# EAGLE design power_injector 0.7 (EAGLE 6.6.0)
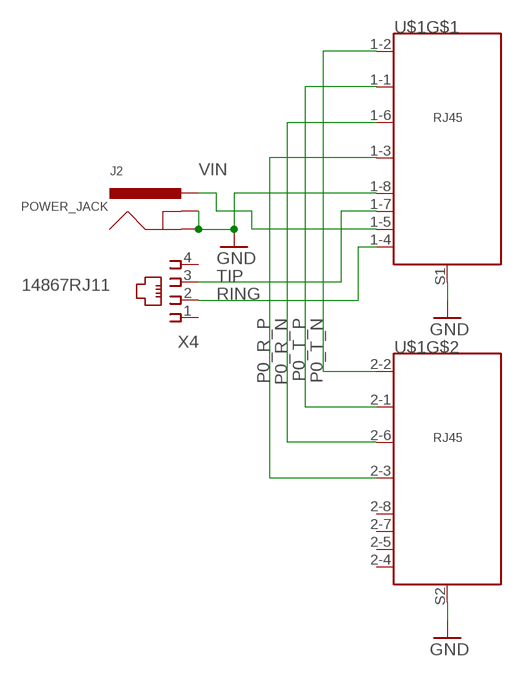
[diagram p0: schematic, sheet 1]

## Parts
J2  POWER_JACK  [POWER_JACK_SLOT1]
U$1  ETHERNET_2PORT  [ETHERNET-1X2]
X4  14867RJ11  [14867]

## Nets
GND: J2.GND@1(GNDBREAK) J2.GND@2(GND) U$1.1-8 U$1.S1(SHIELD) U$1.S2(SHIELD)
P0_R_N: U$1.1-6 U$1.2-6
P0_R_P: U$1.1-3 U$1.2-3
P0_T_N: U$1.1-2 U$1.2-2
P0_T_P: U$1.1-1 U$1.2-1
RING: U$1.1-4 X4.2
TIP: U$1.1-7 X4.3
VIN: J2.PWR U$1.1-5
Unconnected: U$1.2-4 U$1.2-5 U$1.2-7 U$1.2-8 X4.1 X4.4

## Library data of the parts
J2 = dragino:POWER_JACK: Power Jack This is the standard 5.5mm barrel jack for power. The PTH is the most common, proven, reliable, footprint. All others are experimental. The Slot footprint only works if the mill layer is transmitted to the PCB fab house so be warned. Spark Fun Electronics SKU : PRT-00119. Mating wall wart : TOL-00298 (and others)
U$1 = dragino-passive:ETHERNET_2PORT
X4 = dragino:14867: RJ11 Connector Source: 4UCON TECHNOLOGY INC. 14867.pdf; OC_FARNELL: unknown; OC_NEWARK: unknown

## Board
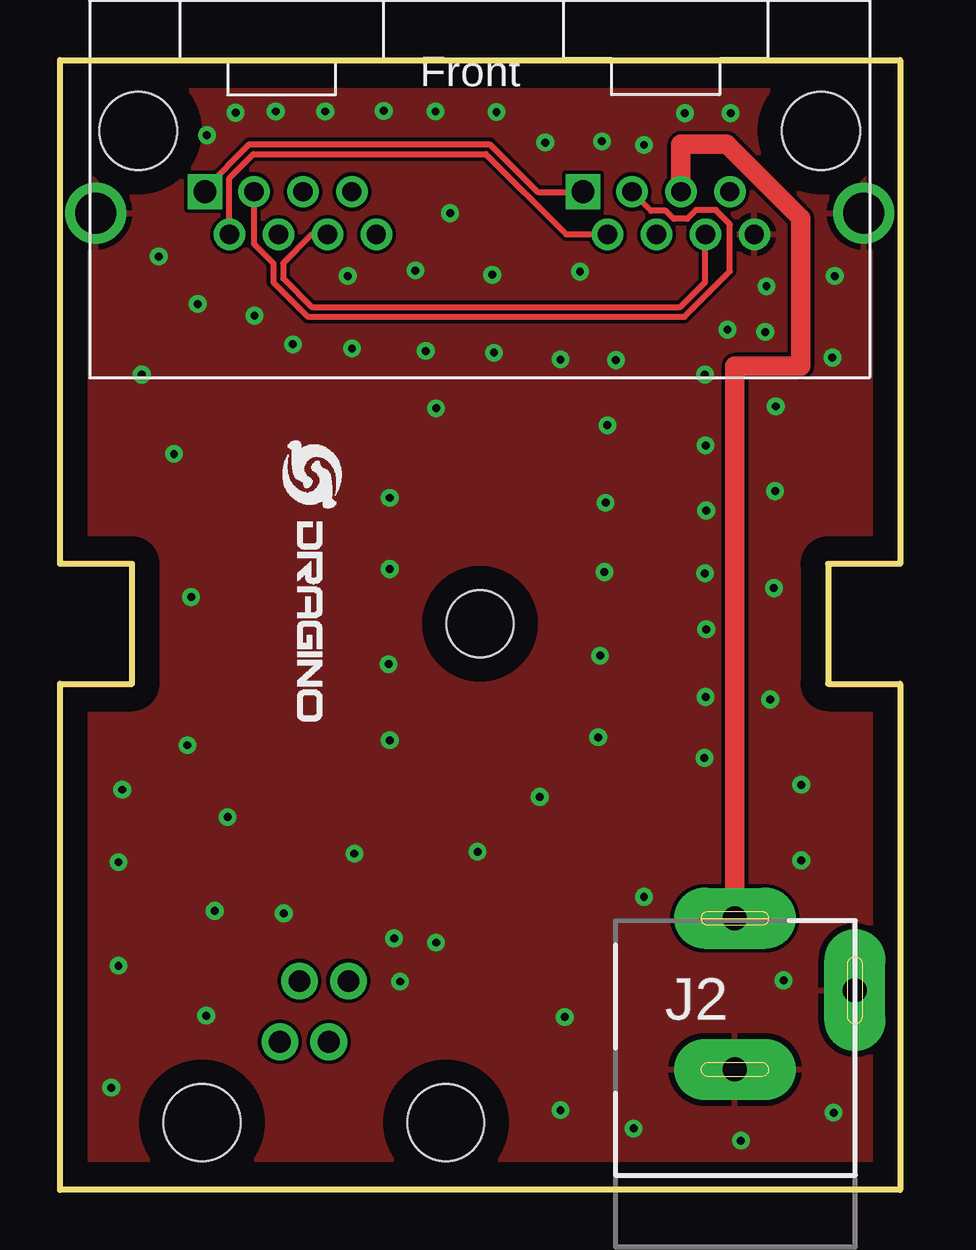
[diagram p1: board, top side]
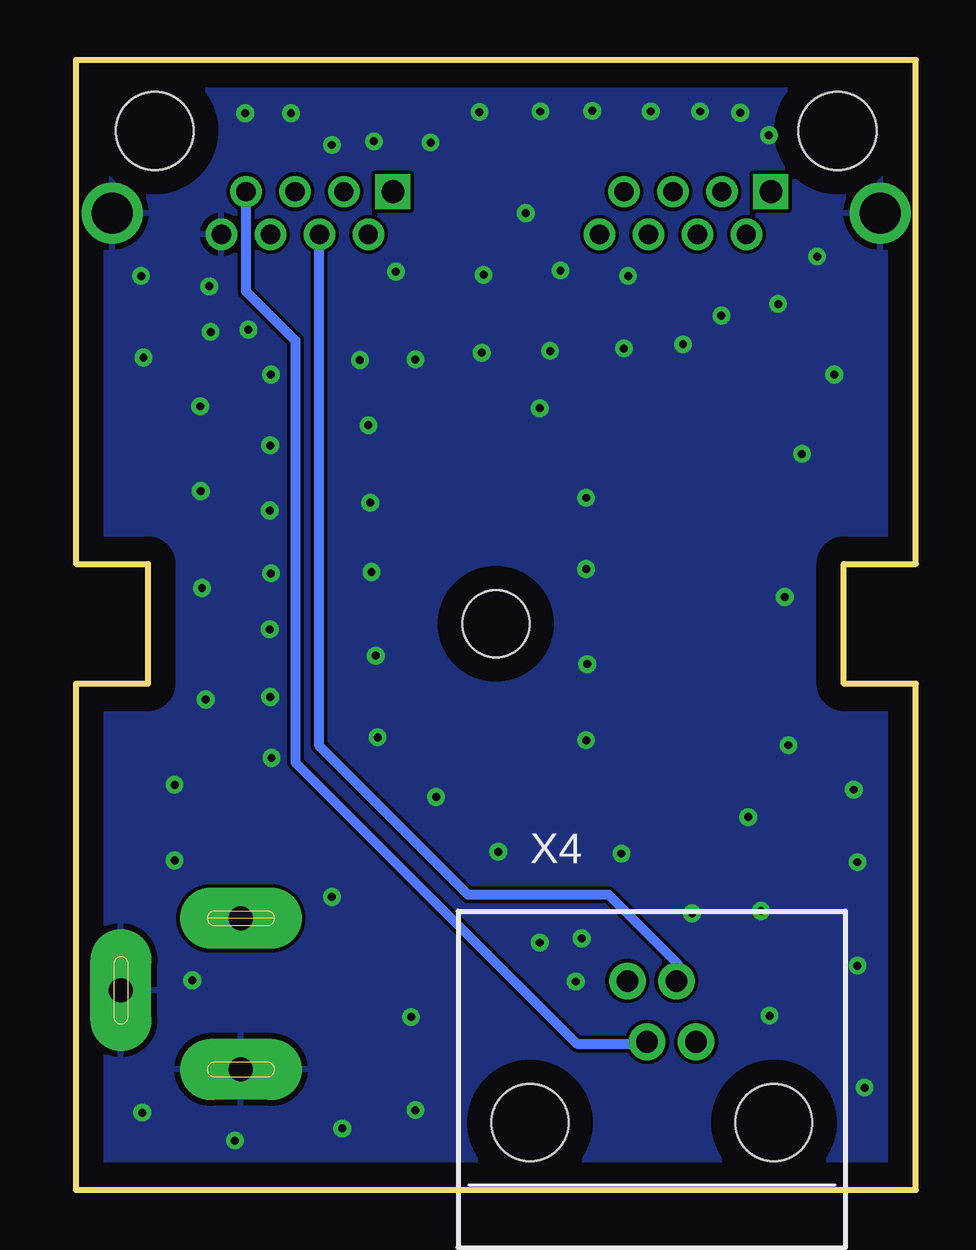
[diagram p2: board, bottom side, seen from below]

Size 35 x 47.1 mm. Coordinates in mm from the lower left corner, seen from the top.
Outline: 0,47.1 35,47.1 35,26.1 32,26.1 32,21.1 35,21.1 35,0 0,0 0,21.1 3,21.1 3,26.1 0,26.1 0,47.1
Copper layers (1*16): Top 0.035mm / dielectric 1.5mm / Bottom 0.035mm
Design rules "default *": minimum track width 10mil, minimum drill 12mil, track to track 6mil, track to pad 6mil, pad to pad 6mil, via to via 6mil, smd to smd 6mil, copper to edge 40mil, drill to drill 8mil, minimum pad ring 10mil, minimum via ring 8mil, stop-mask expansion 4mil, vias tented up to drill 0mil, thermal gap 10mil
Holes 2.8 mm at 17.5,23.6

### Footprints (pad centres in the part's own frame; a part is rotated, then mirrored left to right if it is on the bottom)
POWER_JACK_SLOT1 = drill 1 pad 2.54 long: GND@1 2.58,7.5; GND@2 7.58,10.8; PWR 2.58,13.8
ETHERNET-1X2 = drill 0.94 pad 1.27 square: 1-1 4.305,-2.54; 2-1 -11.445,-2.54 | drill 0.8: 1-2 5.325,-4.32; 1-3 6.345,-2.54; 1-4 7.365,-4.32; 1-5 8.385,-2.54; 1-6 9.405,-4.32; 1-7 10.425,-2.54; 1-8 11.445,-4.32; 2-2 -10.425,-4.32; 2-3 -9.405,-2.54; 2-4 -8.385,-4.32; 2-5 -7.365,-2.54; 2-6 -6.345,-4.32; 2-7 -5.325,-2.54; 2-8 -4.305,-4.32 | drill 1.7: S1 16,-3.43; S2 -16,-3.43 | hole 3.25: -14.225,0; 14.225,0
14867 = drill 0.9 pad 1.524: 1 1.84,3.36; 2 1.02,5.9; 3 -0.2,3.36; 4 -1.02,5.9 | hole 3.2: -5.08,0; 5.08,0

### Placement (x,y rotation side)
J2  25.54,-2.48 0 top
U$1  17.49,44.15 0 top
U$2  [LOGO-SILK-NEW]  9.27,31.24 270 top
X4  11,2.81 0 bottom

### Tracks (layer width: path | path; a pad name or v marks a point on that pad's centre or on a via)
GND  (via drill 0.33)
  other vias: 15.67,32.59 4.11,38.91 5.74,36.93 3.4,33.98 4.75,30.68 5.46,24.71 5.31,18.54 2.59,16.68 2.44,13.66 2.44,9.34 2.13,4.26 6.1,7.26 6.45,11.63 6.99,15.54 13.92,10.49 14.17,8.68 15.67,10.31 24.33,12.21 30.15,8.73 32.23,3.22 28.37,2.05 23.9,2.56 20.85,3.32 21.03,7.21 30.89,13.74 30.89,16.89 26.85,18.01 26.9,20.55 26.92,23.37 26.87,25.7 26.92,28.32 26.9,31.04 26.87,33.98 27.81,35.86 29.39,35.76 29.44,37.67 8.1,36.45 9.7,35.25 12.17,35.07 15.24,34.97 18.08,34.9 20.85,34.62 23.16,34.59 9.32,11.53 12.27,14.02 17.4,14.09 19.99,16.38 22.43,18.87 22.5,22.27 22.68,25.75 22.73,28.65 22.81,31.87 32.28,38.1 32.18,34.69 29.82,32.66 29.79,29.13 29.74,25.09 29.59,20.44 6.12,43.96 7.32,44.9 8.99,44.95 11.05,44.95 13.49,44.98 15.65,44.95 18.19,44.93 20.22,43.66 22.58,43.71 16.26,40.71 14.81,38.33 18.01,38.15 21.67,38.27 11.99,38.1 27.94,44.88 26.04,44.88 24.33,43.56 13.74,28.85 13.74,25.88 13.69,21.92 13.74,18.74
  pour Top: 0,-0.2 35,-0.2 35,47.4 0,47.4
  pour Bottom: 0,47.4 0,-0.2 35,-0.2 35,47.4
P0_R_N
  Top 0.254: U$1.2-6 10.5,39.83 9.3,38.63 9.3,38 10.5,36.8 25.85,36.8 26.88,37.83 U$1.1-6
P0_R_P
  Top 0.254: U$1.2-3 8.08,39.44 8.89,38.63 8.89,37.84 10.33,36.4 26.02,36.4 27.91,38.29 27.91,40.26 27.33,40.84 26.49,40.84 26.14,40.48 25.58,40.48 25.25,40.82 24.63,40.82 U$1.1-3
P0_T_N
  Top 0.254: U$1.2-2 7.06,42.18 8.06,43.18 17.75,43.18 21.09,39.83 U$1.1-2
P0_T_P
  Top 0.254: U$1.2-1 6.04,41.73 7.89,43.58 17.91,43.58 19.91,41.59 21.77,41.59 U$1.1-1
RING
  Bottom 0.406: X4.2 9.91,8.48 9.91,9.39 12.83,12.32 18.67,12.32 24.85,18.5 U$1.1-4
TIP
  Bottom 0.406: U$1.1-7 27.91,37.46 25.86,35.41 25.86,17.83 14.12,6.09 11.28,6.09 X4.3
VIN
  Top 0.813: U$1.1-5 25.87,43.58 27.79,43.58 30.86,40.51 30.86,34.34 28.12,34.34 J2.PWR

### Text on the board
tDocu: Power Injector 0.7